# Altium schematic sheet Top.SchDoc
size A4; SheetNumber: 1; SheetTotal: 4
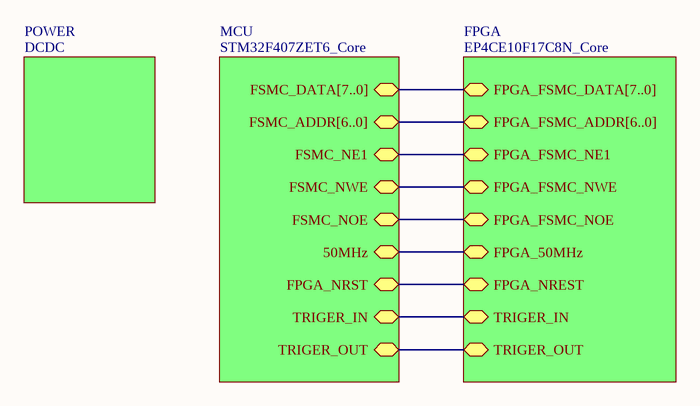
[diagram p0: Top.SchDoc]

## Sub-sheets
FPGA = EP4CE10F17C8N_Core: FPGA_FSMC_DATA[7..0] (bidir), FPGA_50MHz (bidir), FPGA_FSMC_ADDR[6..0] (bidir), FPGA_NREST (bidir), FPGA_FSMC_NE1 (bidir), FPGA_FSMC_NWE (bidir), FPGA_FSMC_NOE (bidir), TRIGER_IN (bidir), TRIGER_OUT (bidir)
MCU = STM32F407ZET6_Core: FSMC_DATA[7..0] (bidir), 50MHz (bidir), FSMC_ADDR[6..0] (bidir), FPGA_NRST (bidir), FSMC_NE1 (bidir), FSMC_NWE (bidir), FSMC_NOE (bidir), TRIGER_IN (bidir), TRIGER_OUT (bidir)
POWER = DCDC: no entries

## Nets
(unnamed): sheet MCU/50MHz, sheet FPGA/FPGA_50MHz
(unnamed): sheet MCU/FPGA_NRST, sheet FPGA/FPGA_NREST
(unnamed): sheet MCU/FSMC_NE1, sheet FPGA/FPGA_FSMC_NE1
(unnamed): sheet MCU/FSMC_NWE, sheet FPGA/FPGA_FSMC_NWE
(unnamed): sheet MCU/FSMC_NOE, sheet FPGA/FPGA_FSMC_NOE
(unnamed): sheet MCU/TRIGER_IN, sheet FPGA/TRIGER_IN
(unnamed): sheet MCU/TRIGER_OUT, sheet FPGA/TRIGER_OUT

## Buses and harness runs
bus sheet FPGA/FPGA_FSMC_ADDR[6..0] = sheet MCU/FSMC_ADDR[6..0]
bus sheet FPGA/FPGA_FSMC_DATA[7..0] = sheet MCU/FSMC_DATA[7..0]